# EAGLE design sun2usb (EAGLE 7.5.0)
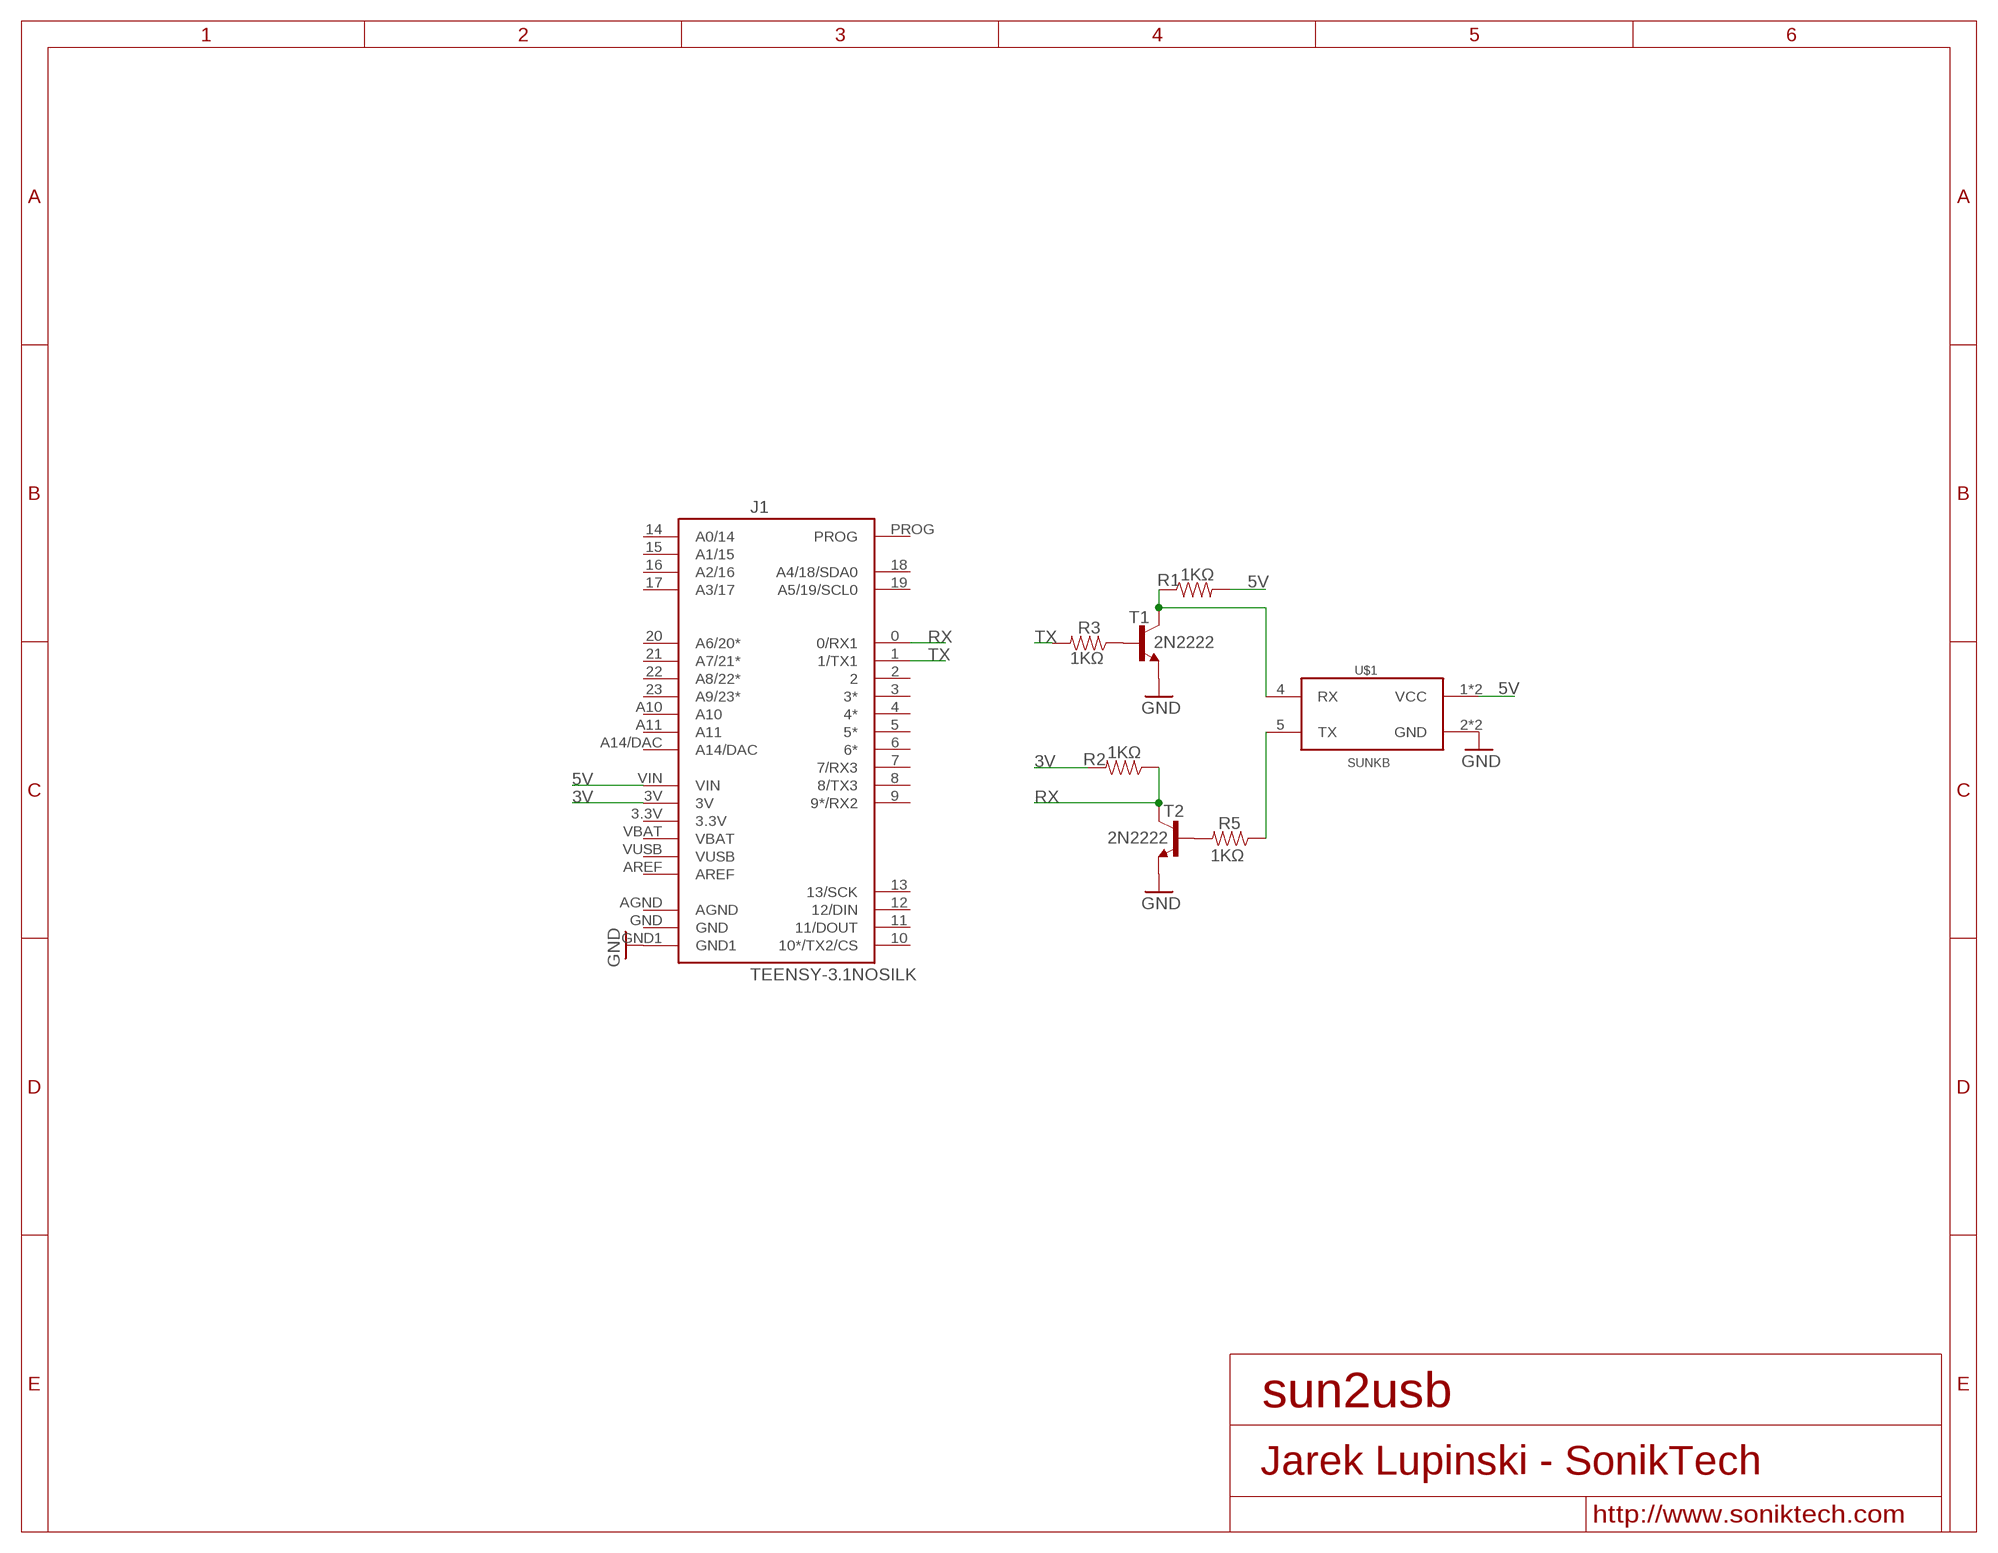
[diagram p0: schematic, sheet 1]

## Parts
J1  TEENSY-3.1NOSILK  [TEENSY-3.1_NOSILK]
R1  1KΩ  RESISTORPTH-1/4W  [AXIAL-0.4]
R2  1KΩ  RESISTORPTH-1/4W  [AXIAL-0.4]
R3  1KΩ  RESISTORPTH-1/4W  [AXIAL-0.4]
R5  1KΩ  RESISTORPTH-1/4W  [AXIAL-0.4]
T1  2N2222  [TO92-EBC-OVAL]
T2  2N2222  [TO92-EBC-OVAL]
U$1  SUNKB  [MINI8DIN]

## Nets
3V: J1.3V R2.P$2
5V: J1.VIN R1.P$2 U$1.1(VCC) U$1.8(VCC)
GND: J1.GND1 T1.E T2.E U$1.2(GND) U$1.3(GND)
N$1: R5.P$1 U$1.5(TX)
N$2: R1.P$1 T1.C U$1.4(RX)
N$3: R3.P$1 T1.B
N$4: R5.P$2 T2.B
RX: J1.0(0/RX1) R2.P$1 T2.C
TX: J1.1(1/TX1) R3.P$2
Unconnected: J1.2 J1.3(3*) J1.3.3V J1.4(4*) J1.5(5*) J1.6(6*) J1.7(7/RX3) J1.8(8/TX3) J1.9(9*/RX2) J1.10(10*/TX2/CS) J1.11(11/DOUT) J1.12(12/DIN) J1.13(13/SCK) J1.14(A0/14) J1.15(A1/15) J1.16(A2/16) J1.17(A3/17) J1.18(A4/18/SDA0) J1.19(A5/19/SCL0) J1.20(A6/20*) J1.21(A7/21*) J1.22(A8/22*) J1.23(A9/23*) J1.A10 J1.A11 J1.A14/DAC J1.AGND J1.AREF J1.GND J1.PROG J1.VBAT J1.VUSB

## Library data of the parts
J1 = SparkFun-Boards:TEENSY-3.1; SF_ID: DEV-12646
R1-R3 R5 = SparkFun-Resistors:RESISTOR: Resistor Basic schematic elements and footprints for 0603, 1206, and PTH resistors.
T1 T2 = adafruit:2N2222: NPN TRANSISTOR Big oval pads
U$1 = sonik:SUNKB

## Board
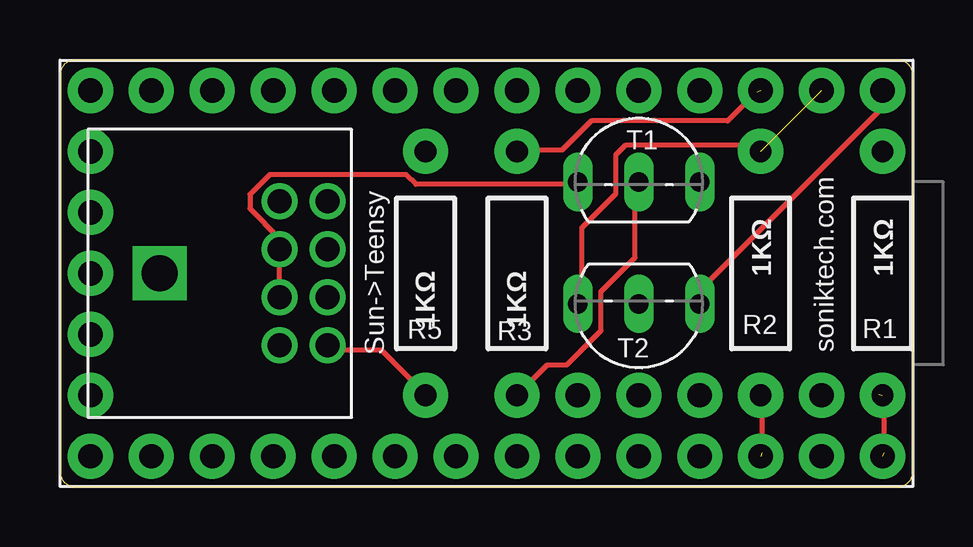
[diagram p1: board, top side]
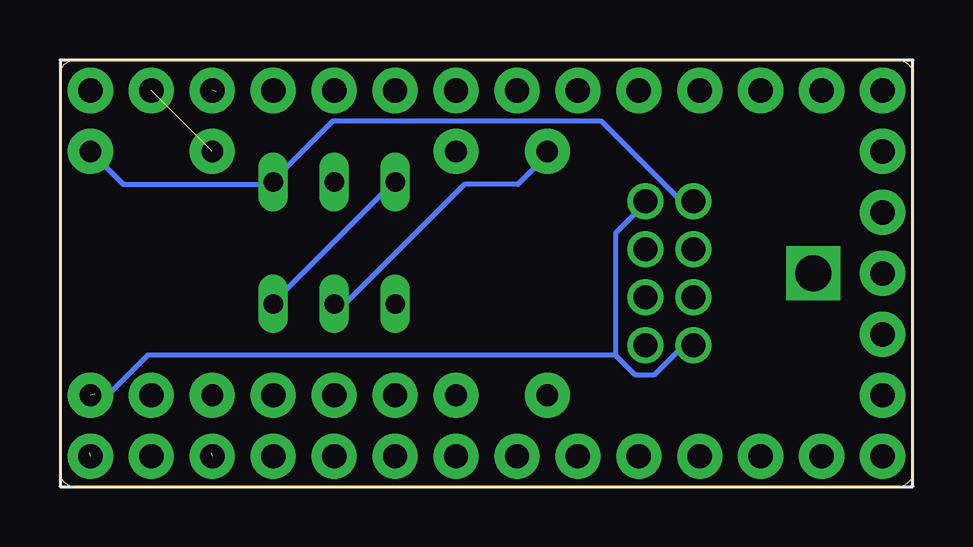
[diagram p2: board, bottom side, seen from below]

Size 35.56 x 17.78 mm. Coordinates in mm from the lower left corner, seen from the top.
Outline: 0,17.14 0,0.64 arc90 0.64,0 34.92,0 arc90 35.56,0.64 35.56,17.14 arc90 34.92,17.78 0.64,17.78 arc90 0,17.14
Copper layers (1*16): Top 0.0356mm / dielectric 1.5011mm / Bottom 0.0356mm
Design rules "OSHparkDruTented8mil": minimum track width 8mil, minimum drill 13mil, track to track 8mil, track to pad 8mil, pad to pad 8mil, via to via 8mil, smd to smd 5mil, copper to edge 15mil, drill to drill 6mil, minimum pad ring 5mil, minimum via ring 5mil, stop-mask expansion 3mil, vias tented up to drill 14mil, thermal gap 10mil

### Footprints (pad centres in the part's own frame; a part is rotated, then mirrored left to right if it is on the bottom)
TEENSY-3.1_NOSILK = drill 1.016 pad 1.88: 0 16.51,3.81; 1 16.51,6.35; 2 16.51,8.89; 3 16.51,11.43; 3.3V 11.43,34.29; 3V 1.27,6.35; 4 16.51,13.97; 5 16.51,16.51; 6 16.51,19.05; 7 16.51,21.59; 8 16.51,24.13; 9 16.51,26.67; 10 16.51,29.21; 11 16.51,31.75; 12 16.51,34.29; 13 1.27,34.29; 14 1.27,31.75; 15 1.27,29.21; 16 1.27,26.67; 17 1.27,24.13; 18 1.27,21.59; 19 1.27,19.05; 20 1.27,16.51; 21 1.27,13.97; 22 1.27,11.43; 23 1.27,8.89; A10 3.81,11.43; A11 3.81,13.97; A14/DAC 3.81,34.29; AGND 1.27,3.81; AREF 3.81,8.89; GND 8.89,34.29; GND1 16.51,1.27; PROG 6.35,34.29; VBAT 13.97,34.29; VIN 1.27,1.27; VUSB 3.81,3.81
AXIAL-0.4 = drill 0.9 pad 1.88: P$1 -5.08,0; P$2 5.08,0
TO92-EBC-OVAL = drill 0.813 long: B 0,-1.27; C 2.54,-1.27; E -2.54,-1.27
MINI8DIN = drill 1: 1 -3,1; 2 -1,1; 3 1,1; 4 3,1; 5 -3,-1; 6 -1,-1; 7 1,-1; 8 3,-1 | drill 1.5 square: P$1 0,6

### Placement (x,y rotation side)
J1  35.56,0 90 top
R1  34.29,8.89 270 top
R2  29.21,8.89 270 top
R3  19.05,8.89 90 top
R5  15.24,8.89 90 top
T1  24.13,13.97 0 top
T2  24.13,6.35 180 top
U$1  10.16,8.89 90 top

### Tracks (layer width: path | path; a pad name or v marks a point on that pad's centre or on a via)
3V  (1 unrouted)
  Top 0.203: 29.26,1.42 29.26,3.66 R2.P$2
5V  (2 unrouted)
  Top 0.203: 34.34,1.42 34.34,3.66 R1.P$2
  Bottom 0.203: 12.39,5.49 11.58,4.67 10.77,4.67 9.75,5.69 9.35,5.69 U$1.1 | 12.39,5.49 12.39,10.57 11.18,11.79 U$1.8 | 34.14,3.86 33.53,3.86 31.9,5.49 12.39,5.49
GND
  Top 0.203: U$1.2 9.14,7.92 9.14,9.75 U$1.3 9.14,9.96 9.14,10.36 7.92,11.58 7.92,12.19 8.74,13.01 14.43,13.01 14.83,12.6 21.54,12.6 T1.E | J1.GND1 34.14,16.46 34.14,15.65 26.82,8.33 26.82,7.72 T2.E
  Bottom 0.203: T2.E 26.62,7.72 21.74,12.6 T1.E
N$1
  Top 0.203: U$1.5 11.18,5.69 13.41,5.69 15.24,3.86 R5.P$1
N$2
  Bottom 0.203: R1.P$1 32.92,12.6 26.82,12.6 T1.C 26.62,12.8 24.18,15.24 13.01,15.24 9.75,11.99 9.35,11.99 U$1.4
N$3
  Top 0.203: R3.P$1 20.32,5.08 21.13,5.08 22.55,6.5 22.55,8.13 23.98,9.55 23.98,12.6 T1.B
N$4
  Bottom 0.203: T2.B 23.98,7.72 23.57,7.72 18.69,12.6 16.46,12.6 15.24,13.82 R5.P$2
RX  (1 unrouted)
  Top 0.203: T2.C 21.74,7.72 21.74,10.77 23.16,12.19 23.16,13.82 23.57,14.22 28.85,14.22 29.06,14.02 R2.P$1
TX  (1 unrouted)
  Top 0.203: 29.06,16.46 27.84,15.24 22.15,15.24 20.93,14.02 19.1,14.02 R3.P$2

### Text on the board
tNames: Sun->Teensy | soniktech.com
tValues: 1KΩ | 1KΩ | 1KΩ | 1KΩ